# EasyEDA schematic MOTHER BOARD SCHEMATIC.json
TITLE: DT MIDI UNO; REV: 1.0; Date: 2023-08-12; Sheet: 1/1; Drawn By: daifresne; Company: TSGP LAB
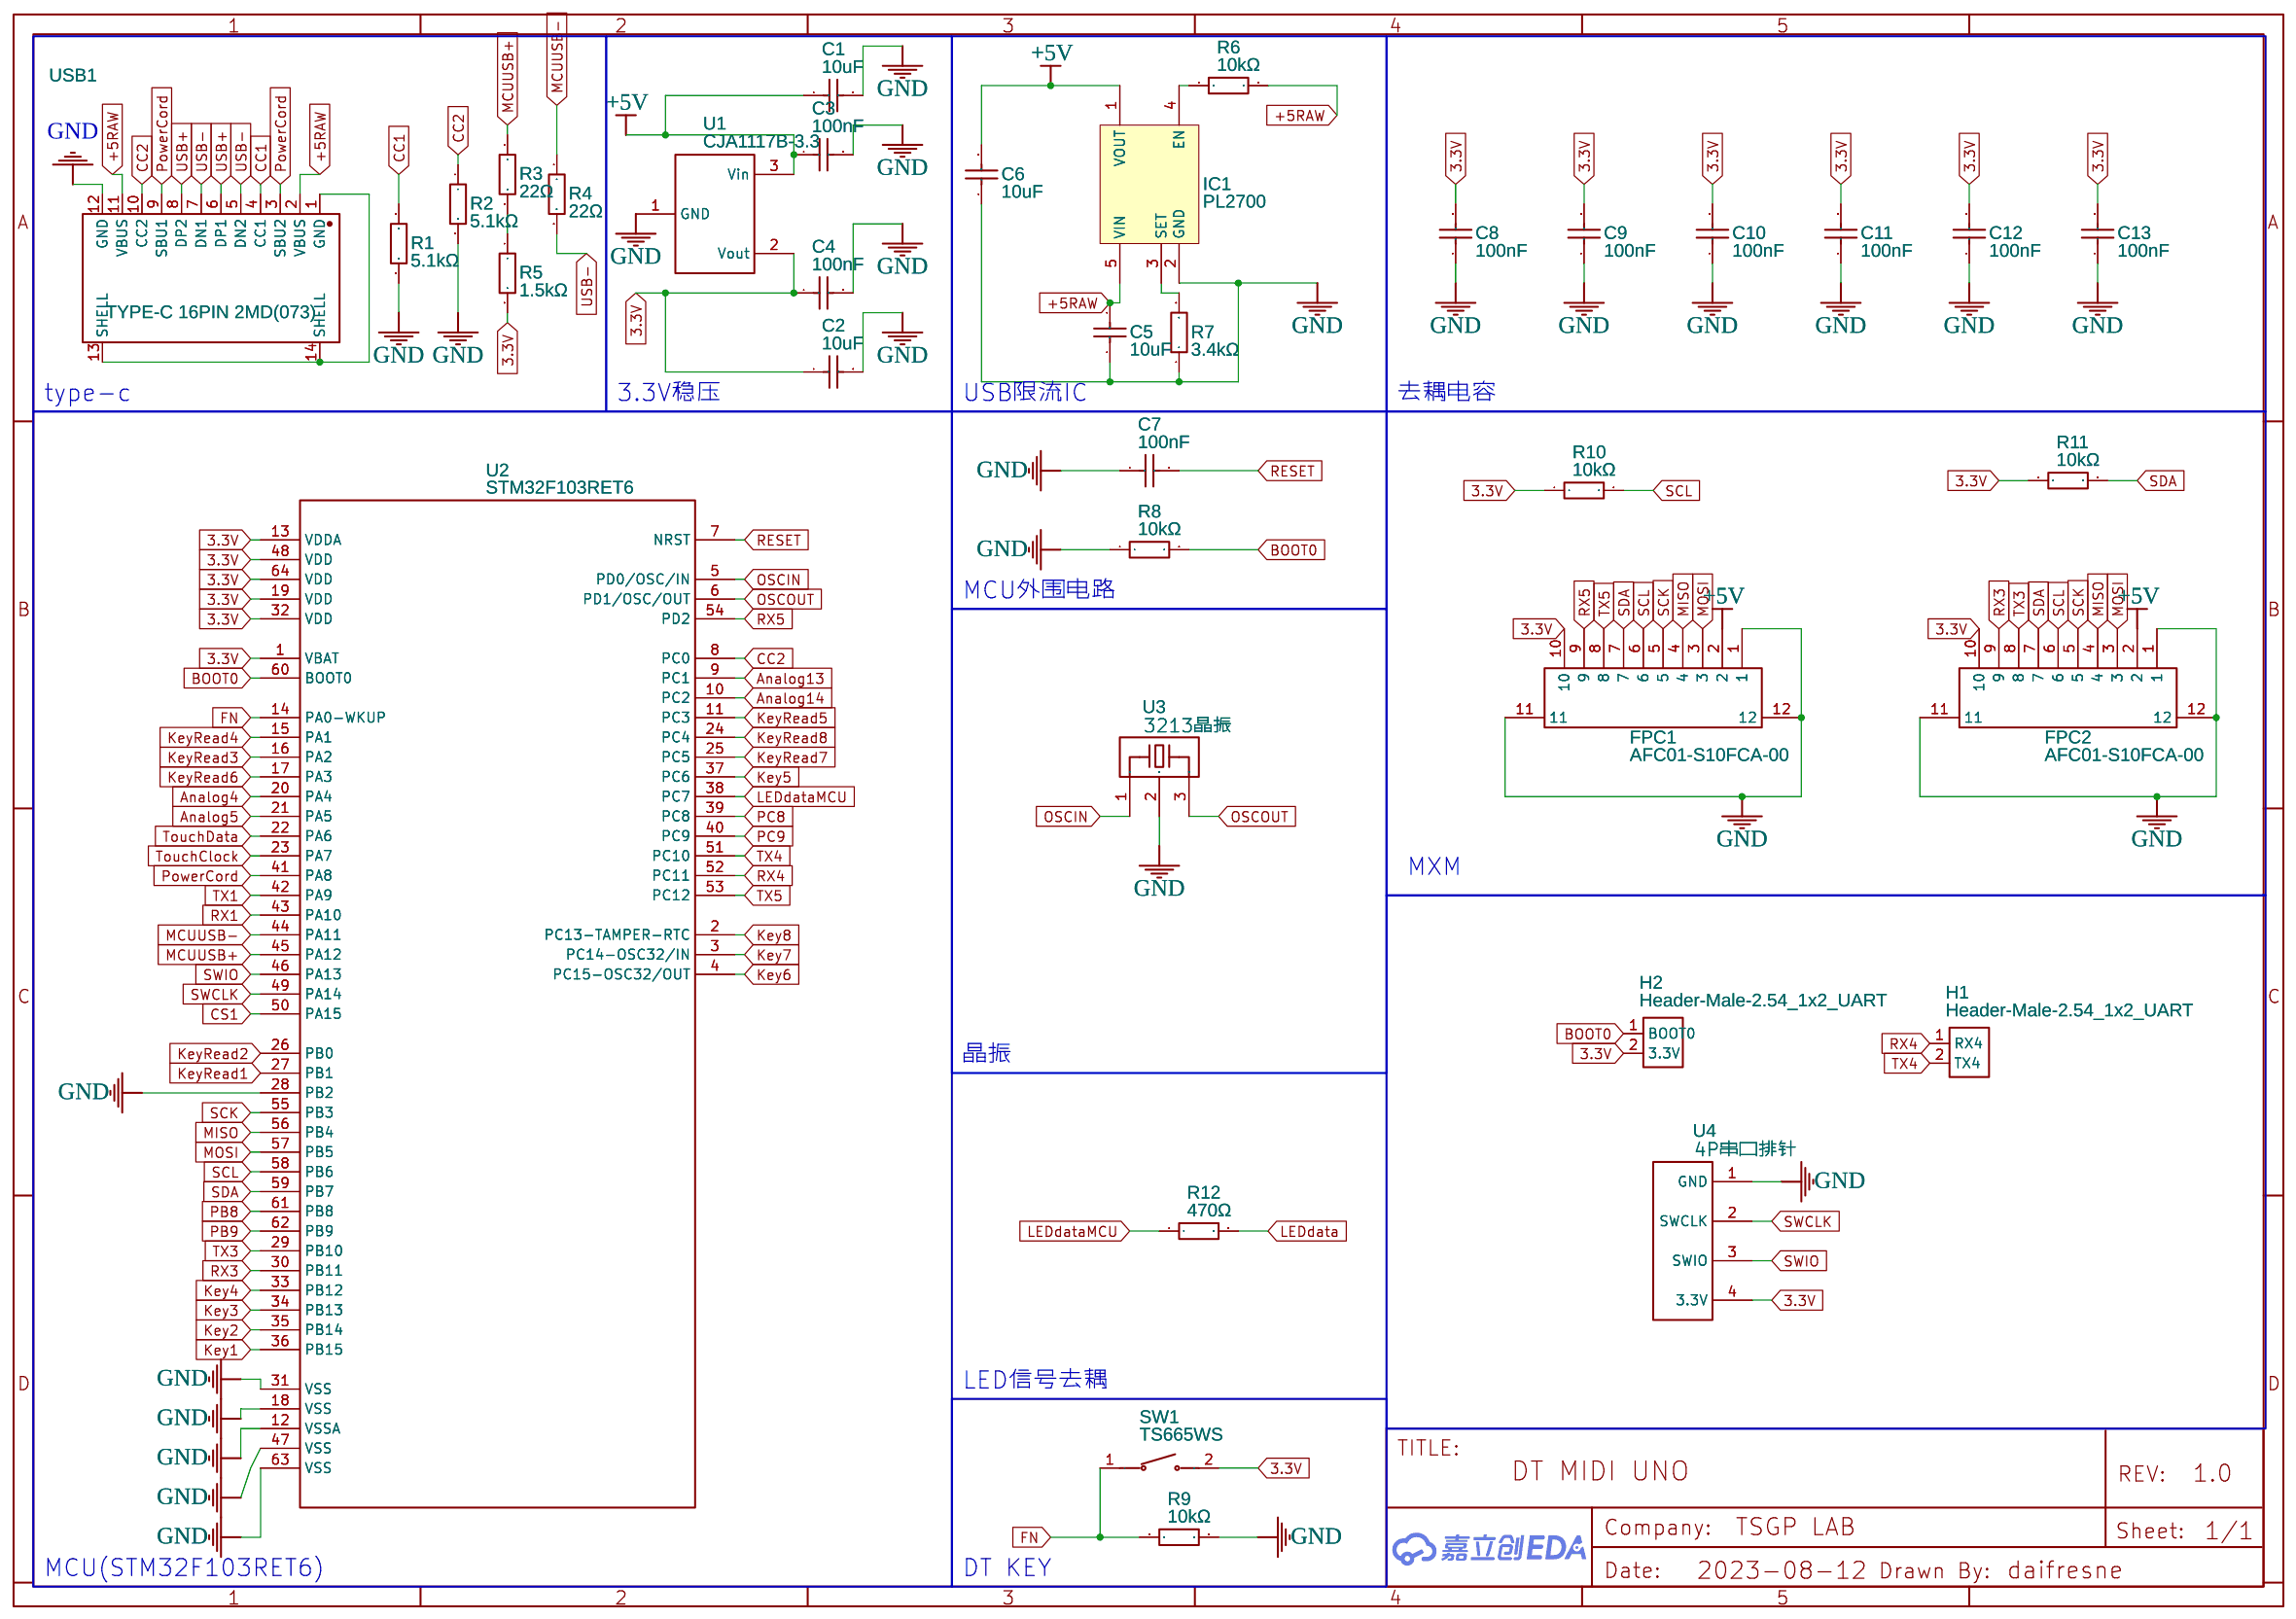
[diagram p0: schematic sheet]

## Parts
C1  10uF  [C0805]
C2  10uF  [C0805]
C3  100nF  [C0603]
C4  100nF  [C0603]
C5  10uF  [C0805]
C6  10uF  [C0805]
C7  100nF  [C0603]
C8  100nF  [C0603]
C9  100nF  [C0603]
C10  100nF  [C0603]
C11  100nF  [C0603]
C12  100nF  [C0603]
C13  100nF  [C0603]
FPC1  AFC01-S10FCA-00  [FPC-SMD_P0.5-10P_FGS-XJ-H2.0]
FPC2  AFC01-S10FCA-00  [FPC-SMD_P0.5-10P_FGS-XJ-H2.0]
H1  Header-Male-2.54_1x2_UART  [HDR-F-2.54_1X2_UART]
H2  Header-Male-2.54_1x2_UART  [HDR-F-2.54_1X2_UART]
IC1  PL2700  [SOT23-5]
R1  5.1kΩ  [R0603]
R2  5.1kΩ  [R0603]
R3  22Ω  [R0603]
R4  22Ω  [R0603]
R5  1.5kΩ  [R0603]
R6  10kΩ  [R0805]
R7  3.4kΩ  [R0603]
R8  10kΩ  [R0805]
R9  10kΩ  [R0805]
R10  10kΩ  [R0805]
R11  10kΩ  [R0805]
R12  470Ω  [R0603]
SW1  TS665WS  [SW-SMD_L6.0-W6.0-LS6.6]
U1  CJA1117B-3.3  [SOT-89-3_L4.5-W2.5-P1.50-LS4.2-BR]
U2  STM32F103RET6  [LQFP-64_L10.0-W10.0-P0.50-LS12.0-BL]
U3  3213晶振  [3213晶振]
U4  4P串口排针  [4P]
USB1  TYPE-C 16PIN 2MD(073)  [USB-C-SMD_TYPE-C-6PIN-2MD-073]

## Library data of the parts
C1 C2 C5 C6 = CL21A106KAYNNNE: Supplier: LCSC; Manufacturer: SAMSUNG(三星); Supplier Part: C15850; JLCPCB Part Class: Basic Part
C3 C4 C7-C13 = CC0603KRX7R8BB104: Supplier: LCSC; Manufacturer: YAGEO(国巨); Supplier Part: C92490; JLCPCB Part Class: Extended Part
FPC1 FPC2 = AFC01-S10FCA-00: Contributor: LCSC; Supplier: LCSC; Supplier Part: C262659; Manufacturer: JS(钜硕电子); JLCPCB Part Class: Extended Part
H1 H2 = Header-Male-2.54_1x2_UART: Supplier: LCSC; Manufacturer: TE Connectivity; Manufacturer Part: 826629-2; Supplier Part: C86471; JLCPCB Part Class: Extended Part; Contributor: Last_ID
IC1 = PL2700: Contributor: cybinlyc
R1 R2 = RT0603BRD075K1L: Supplier: LCSC; Manufacturer: YAGEO(国巨); Supplier Part: C122969; JLCPCB Part Class: Extended Part
R3 R4 = 0603WAF220JT5E: Supplier: LCSC; Manufacturer: UNI-ROYAL(厚声); Supplier Part: C23345; JLCPCB Part Class: Basic Part
R5 = 0603WAF1501T5E: Supplier: LCSC; Manufacturer: UNI-ROYAL(厚声); Supplier Part: C22843; JLCPCB Part Class: Basic Part
R6 R8-R11 = RT0805BRD0710KL: Supplier: LCSC; Manufacturer: YAGEO(国巨); Supplier Part: C110775; JLCPCB Part Class: Extended Part
R7 = 0603WAF3401T5E: Supplier: LCSC; Manufacturer: UNI-ROYAL(厚声); Supplier Part: C22997; JLCPCB Part Class: Extended Part
R12 = 0603WAF4700T5E: Supplier: LCSC; Manufacturer: UNI-ROYAL(厚声); Supplier Part: C23179; JLCPCB Part Class: Basic Part
SW1 = TS665WS: Contributor: LCSC; Supplier: LCSC; Supplier Part: C398058; Manufacturer: SHOU HAN(首韩); JLCPCB Part Class: Extended Part
U1 = CJA1117B-3.3: Supplier: LCSC; Manufacturer: CJ(江苏长电/长晶); Supplier Part: C24253; JLCPCB Part Class: Extended Part
U2 = STM32F103RET6: Supplier: LCSC; Manufacturer: ST(意法半导体); Supplier Part: C8322; JLCPCB Part Class: Extended Part
U3 = 3213晶振: Contributor: 5_6956
U4 = 4P串口排针: Contributor: cyqwmh
USB1 = TYPE-C 16PIN 2MD(073): Contributor: LCSC; Supplier: LCSC; Supplier Part: C2765186; Manufacturer: SHOU HAN(首韩); JLCPCB Part Class: Extended Part

## Nets
3.3V: C2.1 C4.1 C8.2 C9.2 C10.2 C11.2 C12.2 C13.2 FPC1.10 FPC2.10 H2.2(3.3V) R5.2 R10.1 R11.1 SW1.2(B) U1.2(Vout) U2.1(VBAT) U2.13(VDDA) U2.19(VDD) U2.32(VDD) U2.48(VDD) U2.64(VDD) U4.4(3.3V)
+5V: C1.1 C3.1 C6.2 FPC1.2 FPC2.2 IC1.1(VOUT) U1.3(Vin)
GND: C1.2 C2.2 C3.2 C4.2 C5.1 C6.1 C7.1 C8.1 C9.1 C10.1 C11.1 C12.1 C13.1 FPC1.1 FPC1.11 FPC1.12 FPC2.1 FPC2.11 FPC2.12 IC1.2(GND) R1.1 R2.2 R7.1 R8.1 R9.2 U1.1(GND) U2.12(VSSA) U2.18(VSS) U2.28(PB2) U2.31(VSS) U2.47(VSS) U2.63(VSS) U3.2 U4.1(GND) USB1.12(GND)
+5RAW: C5.2 IC1.5(VIN) R6.2 USB1.2(VBUS) USB1.11(VBUS)
Analog4: U2.20(PA4)
Analog5: U2.21(PA5)
Analog13: U2.9(PC1)
Analog14: U2.10(PC2)
BOOT0: H2.1(BOOT0) R8.2 U2.60(BOOT0)
CC1: R1.2 USB1.4(CC1)
CC2: R2.1 U2.8(PC0) USB1.10(CC2)
CS1: U2.50(PA15)
FN: R9.1 SW1.1(A) U2.14(PA0-WKUP)
Key1: U2.36(PB15)
Key2: U2.35(PB14)
Key3: U2.34(PB13)
Key4: U2.33(PB12)
Key5: U2.37(PC6)
Key6: U2.4(PC15-OSC32/OUT)
Key7: U2.3(PC14-OSC32/IN)
Key8: U2.2(PC13-TAMPER-RTC)
KeyRead1: U2.27(PB1)
KeyRead2: U2.26(PB0)
KeyRead3: U2.16(PA2)
KeyRead4: U2.15(PA1)
KeyRead5: U2.11(PC3)
KeyRead6: U2.17(PA3)
KeyRead7: U2.25(PC5)
KeyRead8: U2.24(PC4)
LEDdata: R12.2
LEDdataMCU: R12.1 U2.38(PC7)
MCUUSB+: R3.1 U2.45(PA12)
MCUUSB-: R4.1 U2.44(PA11)
MISO: FPC1.4 FPC2.4 U2.56(PB4)
MOSI: FPC1.3 FPC2.3 U2.57(PB5)
OSCIN: U2.5(PD0/OSC/IN) U3.1
OSCOUT: U2.6(PD1/OSC/OUT) U3.3
PB8: U2.61(PB8)
PB9: U2.62(PB9)
PC8: U2.39(PC8)
PC9: U2.40(PC9)
PowerCord: U2.41(PA8) USB1.3(SBU2) USB1.9(SBU1)
RESET: C7.2 U2.7(NRST)
RX1: U2.43(PA10)
RX3: FPC2.9 U2.30(PB11)
RX4: H1.1(RX4) U2.52(PC11)
RX5: FPC1.9 U2.54(PD2)
SCK: FPC1.5 FPC2.5 U2.55(PB3)
SCL: FPC1.6 FPC2.6 R10.2 U2.58(PB6)
SDA: FPC1.7 FPC2.7 R11.2 U2.59(PB7)
SWCLK: U2.49(PA14) U4.2(SWCLK)
SWIO: U2.46(PA13) U4.3(SWIO)
TouchClock: U2.23(PA7)
TouchData: U2.22(PA6)
TX1: U2.42(PA9)
TX3: FPC2.8 U2.29(PB10)
TX4: H1.2(TX4) U2.51(PC10)
TX5: FPC1.8 U2.53(PC12)
USB+: USB1.6(DP1) USB1.8(DP2)
USB-: R4.2 USB1.5(DN2) USB1.7(DN1)
Net-(IC1-3): IC1.3(SET) R7.2
Net-(IC1-4): IC1.4(EN) R6.1
Net-(R3-2): R3.2 R5.1
Net-(USB1-1): USB1.1(GND) USB1.13(SHELL) USB1.14(SHELL)

## Notes on the sheet
- type-c
- 3.3V稳压
- USB限流IC
- 去耦电容
- MCU外围电路
- MXM
- 晶振
- LED信号去耦
- MCU(STM32F103RET6)
- DT KEY
